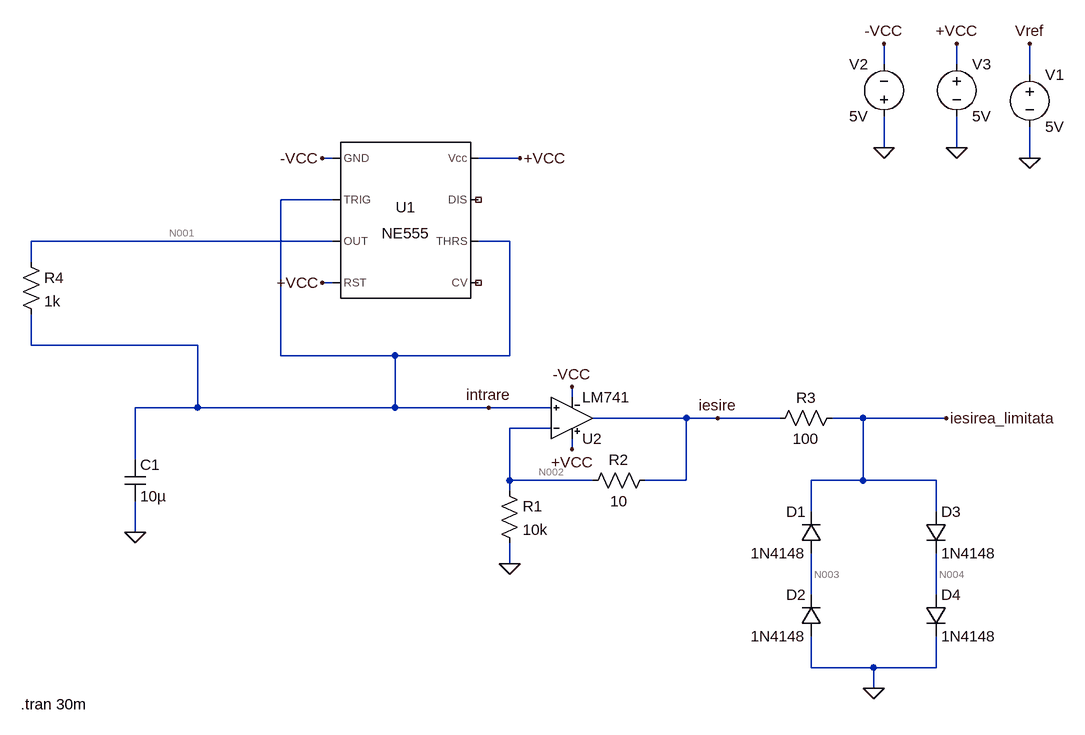
[diagram p0: schematic Limitare.asc]
Limitare.asc, the LTspice schematic file:
Version 4.1
SHEET 1 1064 728
WIRE 768 -272 768 -304
WIRE 880 -272 880 -304
WIRE 992 -256 992 -304
WIRE 768 -144 768 -192
WIRE 880 -144 880 -192
WIRE -80 -128 -96 -128
WIRE 208 -128 144 -128
WIRE 992 -128 992 -176
WIRE -80 -64 -160 -64
WIRE -80 0 -544 0
WIRE 192 0 144 0
WIRE -544 32 -544 0
WIRE -80 64 -96 64
WIRE -544 160 -544 112
WIRE -288 160 -544 160
WIRE -160 176 -160 -64
WIRE 16 176 -160 176
WIRE 192 176 192 0
WIRE 192 176 16 176
WIRE 288 240 288 224
WIRE -288 256 -288 160
WIRE -288 256 -384 256
WIRE 16 256 16 176
WIRE 16 256 -288 256
WIRE 160 256 16 256
WIRE 256 256 160 256
WIRE 464 272 320 272
WIRE 512 272 464 272
WIRE 608 272 512 272
WIRE 736 272 688 272
WIRE 864 272 736 272
WIRE 256 288 192 288
WIRE 288 320 288 304
WIRE -384 336 -384 256
WIRE 192 368 192 288
WIRE 320 368 192 368
WIRE 464 368 464 272
WIRE 464 368 400 368
WIRE 736 368 736 272
WIRE 736 368 656 368
WIRE 848 368 736 368
WIRE 192 384 192 368
WIRE 656 416 656 368
WIRE 848 416 848 368
WIRE -384 448 -384 400
WIRE 192 496 192 464
WIRE 656 544 656 480
WIRE 848 544 848 480
WIRE 656 656 656 608
WIRE 752 656 656 656
WIRE 848 656 848 608
WIRE 848 656 752 656
WIRE 752 688 752 656
FLAG -96 -128 -VCC
FLAG -96 64 +VCC
FLAG -384 448 0
FLAG 208 -128 +VCC
FLAG 752 688 0
FLAG 864 272 iesirea_limitata
FLAG 512 272 iesire
FLAG 288 224 -VCC
FLAG 288 320 +VCC
FLAG 160 256 intrare
FLAG 192 496 0
FLAG 992 -304 Vref
FLAG 992 -128 0
FLAG 768 -144 0
FLAG 768 -304 -VCC
FLAG 880 -144 0
FLAG 880 -304 +VCC
SYMBOL Misc\\NE555 32 -32 R0
SYMATTR InstName U1
SYMBOL cap -400 336 R0
SYMATTR InstName C1
SYMATTR Value 10µ
SYMBOL res 176 368 R0
SYMATTR InstName R1
SYMATTR Value 10k
SYMBOL res 416 352 R90
WINDOW 0 0 56 VBottom 2
WINDOW 3 32 56 VTop 2
SYMATTR InstName R2
SYMATTR Value 10
SYMBOL res 592 288 R270
WINDOW 0 32 56 VTop 2
WINDOW 3 0 56 VBottom 2
SYMATTR InstName R3
SYMATTR Value 100
SYMBOL diode 672 480 R180
WINDOW 0 24 64 Left 2
WINDOW 3 24 0 Left 2
SYMATTR InstName D1
SYMATTR Value 1N4148
SYMBOL diode 672 608 R180
WINDOW 0 24 64 Left 2
WINDOW 3 24 0 Left 2
SYMATTR InstName D2
SYMATTR Value 1N4148
SYMBOL diode 832 416 R0
SYMATTR InstName D3
SYMATTR Value 1N4148
SYMBOL diode 832 544 R0
SYMATTR InstName D4
SYMATTR Value 1N4148
SYMBOL res -560 16 R0
SYMATTR InstName R4
SYMATTR Value 1k
SYMBOL LM741 288 336 M180
SYMATTR InstName U2
SYMBOL voltage 992 -272 R0
SYMATTR InstName V1
SYMATTR Value 5V
SYMBOL voltage 768 -176 R180
WINDOW 0 24 96 Left 2
WINDOW 3 24 16 Left 2
SYMATTR InstName V2
SYMATTR Value 5V
SYMBOL voltage 880 -288 R0
SYMATTR InstName V3
SYMATTR Value 5V
TEXT -560 712 Left 2 !.tran 30m

The netlist it stands for:
* Limitare.asc
X§U1 -VCC intrare N001 +VCC NC_01 intrare NC_02 +VCC NE555  ; pins GND TRIG OUT RST CV THRS DIS Vcc
C1 intrare 0 10µ
R1 N002 0 10k
R2 iesire N002 10
R3 iesire iesirea_limitata 100
D1 N003 iesirea_limitata 1N4148
D2 0 N003 1N4148
D3 iesirea_limitata N004 1N4148
D4 N004 0 1N4148
R4 N001 intrare 1k
X§U2 intrare N002 +VCC -VCC iesire LM741  ; pins In+ In- V+ V- OUT
V1 Vref 0 5V
V2 0 -VCC 5V
V3 +VCC 0 5V
.model D D
.lib standard.dio
.tran 30m
.lib NE555.sub
.lib LM741.lib
.backanno
.end

* Results of the author's LTspice run, read from the files saved beside the schematic
* Operating Point, zero values left out:
*   V(+vcc) = 5 V
*   V(-vcc) = -5 V
*   V(iesire) = 3.368 V
*   V(iesirea_limitata) = 1.457 V
*   V(intrare) = 4.996 V
*   V(n001) = 5 V
*   V(n002) = 3.364 V
*   V(n003) = 728.6 mV
*   V(n004) = 728.7 mV
*   V(vref) = 5 V
*   I(D1) = -2.521 nA
*   I(D2) = -2.521 nA
*   I(D3) = 19.1 mA
*   I(D4) = 19.1 mA
*   I(R1) = 336.4 µA
*   I(R2) = 333.2 µA
*   I(R3) = 19.1 mA
*   I(R4) = 3.424 µA
*   I(V2) = -4.608 mA
*   I(V3) = -24.05 mA
*   Ix(u1:1) = -3.233 mA
*   Ix(u1:2) = 9.996 nA
*   Ix(u1:3) = -3.424 µA
*   Ix(u1:4) = 56 µA
*   Ix(u1:6) = 9.996 nA
*   Ix(u1:8) = 3.18 mA
*   Ix(u2:1) = 3.404 µA
*   Ix(u2:2) = -3.245 µA
*   Ix(u2:28) = -19.43 mA
*   Ix(u2:50) = -1.375 mA
*   Ix(u2:99) = 20.81 mA
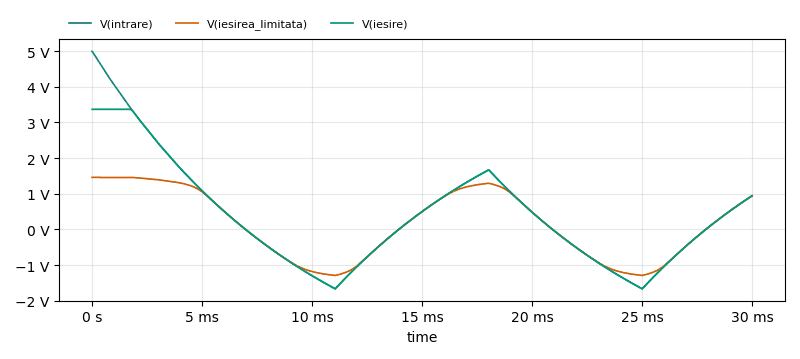
[diagram p1: Transient Analysis of Limitare.asc, plotted from the saved traces]
* Transient Analysis, 1 run:
*   V(intrare): min -1.668 V, max 4.996 V, average 350.7 mV, rms 1.523 V, last 940.8 mV
*   V(iesirea_limitata): min -1.293 V, max 1.457 V, average 116.1 mV, rms 952.2 mV, last 935.1 mV
*   V(iesire): min -1.668 V, max 3.368 V, average 304.3 mV, rms 1.395 V, last 942.7 mV